# Altium project SingleBoardDrone.PrjPcb (part 1 of 2)
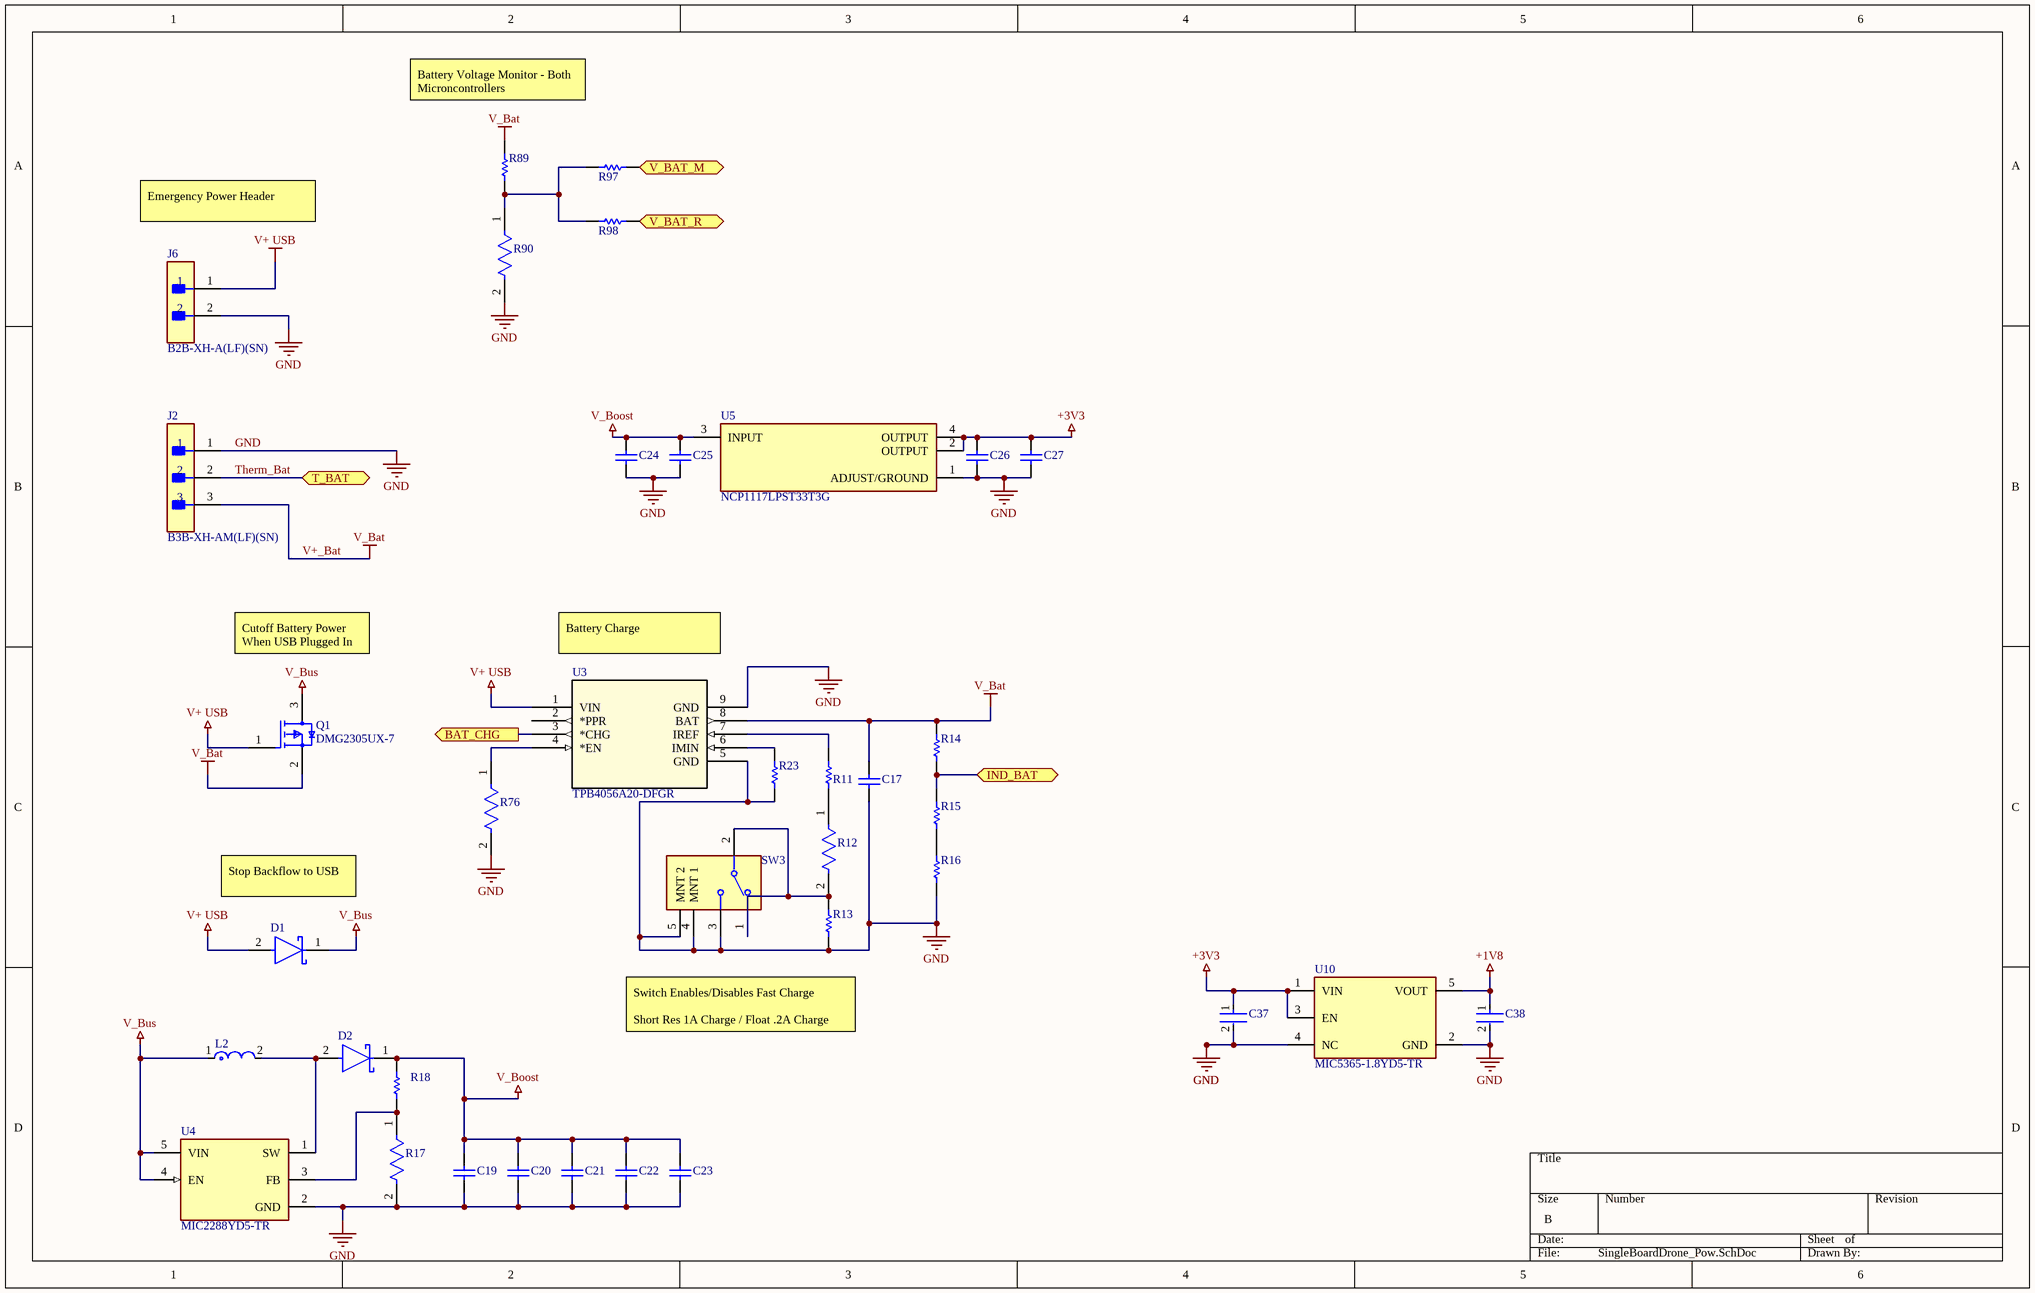
[diagram p0: SingleBoardDrone_Pow.SchDoc]
5 sheets, 230 parts. Net scope: flat (ports and power ports of the same name join across sheets).
Board file: SingleBoardDrone_.PcbDoc
Sheets:
  SingleBoardDrone_Pow.SchDoc
  SingleBoardDrone_RP2350.SchDoc
  SingleBoardDrone_Act.SchDoc
  SingleBoardDrone_Sens.SchDoc
  SingleBoardDrone_RF.SchDoc

## Sheet SingleBoardDrone_Pow.SchDoc
size B; SheetNumber: 1; SheetTotal: 5

### Parts
C17  CL10A475KQ8NNNC  [CAPC1608X90X30LL10T20]  (value not drawn)
C19  CL10A475KQ8NNNC  [CAPC1608X90X30LL10T20]  (value not drawn)
C20  CL10A475KQ8NNNC  [CAPC1608X90X30LL10T20]  (value not drawn)
C21  CL10A475KQ8NNNC  [CAPC1608X90X30LL10T20]  (value not drawn)
C22  CL10A475KQ8NNNC  [CAPC1608X90X30LL10T20]  (value not drawn)
C23  CL10A475KQ8NNNC  [CAPC1608X90X30LL10T20]  (value not drawn)
C24  CL10A475KQ8NNNC  [CAPC1608X90X30LL10T20]  (value not drawn)
C25  CL10A475KQ8NNNC  [CAPC1608X90X30LL10T20]  (value not drawn)
C26  CL10A475KQ8NNNC  [CAPC1608X90X30LL10T20]  (value not drawn)
C27  CL10A475KQ8NNNC  [CAPC1608X90X30LL10T20]  (value not drawn)
C37  CGA3E1X7R1E105K080AC  [FP-CGA3E-0_3-0_1-IPC_A]  (value not drawn)
C38  CGA3E1X7R1E105K080AC  [FP-CGA3E-0_3-0_1-IPC_A]  (value not drawn)
D1  PMEG3020DEP,115  [FP-SOD128-MFG]  (value not drawn)
D2  PMEG3020DEP,115  [FP-SOD128-MFG]  (value not drawn)
J2  B3B-XH-AM(LF)(SN)  [FP-B3B-XH-AM_LF_SN-MFG]
J6  B2B-XH-A(LF)(SN)  [FP-B2B-XH-A_LF_SN-MFG]
L2  VLS5045EX-100M  [FP-VLS5045EX-100M-MFG]  (value not drawn)
Q1  DMG2305UX-7  [FP-SOT23-IPC_B]
R11  ERJ-6ENF2000V  [RESC2013X70X40ML20T20]  (value not drawn)
R12  RMCF0402JT1K00  [FP-RMCF0402-IPC_B]  (value not drawn)
R13  CRCW08055K00FKTA  [RESC2013X50X30ML20T20]  (value not drawn)
R14  CRCW08055K00FKTA  [RESC2013X50X30ML20T20]  (value not drawn)
R15  CRCW08055K00FKTA  [RESC2013X50X30ML20T20]  (value not drawn)
R16  CRCW08055K00FKTA  [RESC2013X50X30ML20T20]  (value not drawn)
R17  RMCF0402JT1K00  [FP-RMCF0402-IPC_B]  (value not drawn)
R18  CRCW08055K00FKTA  [RESC2013X50X30ML20T20]  (value not drawn)
R23  CRCW08055K00FKTA  [RESC2013X50X30ML20T20]  (value not drawn)
R76  RC0402FR-070RL  [FP-RC0402-0_4-IPC_A]  (value not drawn)
R89  CRCW08055K00FKTA  [RESC2013X50X30ML20T20]  (value not drawn)
R90  RMCF0603JG10K0  [FP-RMCF0603-MFG]  (value not drawn)
R97  ERJ-6ENF2000V  [RESC2013X70X40ML20T20]  (value not drawn)
R98  ERJ-6ENF2000V  [RESC2013X70X40ML20T20]  (value not drawn)
SW3  1825232-1  [FP-1825232-1-MFG]  (value not drawn)
U3  TPB4056A20-DFGR  [DFN2X2-8_TPK]
U4  MIC2288YD5-TR  [FP-TSOT-5LD-PL-1-MFG]
U5  NCP1117LPST33T3G  [FP-318H-MFG]
U10  MIC5365-1.8YD5-TR  [FP-TSOT-5LD-PL-1-MFG]

### Ports
BAT_CHG (out, see SingleBoardDrone_RP2350[3B]), IND_BAT (bidir), T_BAT (bidir, see SingleBoardDrone_RP2350[3B]), V_BAT_M (bidir, see SingleBoardDrone_RP2350[3B]), V_BAT_R (bidir, see SingleBoardDrone_RF[3B])

### Nets
+1V8: C38.1 U10.5(VOUT)
+3V3: C26.1 C27.1 C37.1 U5.2(OUTPUT) U5.4(OUTPUT) U10.1(VIN) U10.3(EN)
GND: C17.2 C19.2 C20.2 C21.2 C22.2 C23.2 C24.2 C25.2 C26.2 C27.2 C37.2 C38.2 J2.1 J6.2 R13.2 R16.2 R17.2 R23.2 R76.2 R90.2 SW3.3 SW3.4(MNT_1) SW3.5(MNT_2) U3.5(GND) U3.9(GND) U4.2(GND) U5.1(ADJUST/GROUND) U10.2(GND) U10.4(NC)
V+ USB: D1.2(A) J6.1 Q1.1(GATE) U3.1(VIN)
V+_Bat: C17.1 J2.3 Q1.2(SOURCE) R14.1 R89.1 U3.8(BAT)  [also labelled V_Bat]
V_Boost: C19.1 C20.1 C21.1 C22.1 C23.1 C24.1 C25.1 D2.1(C) R18.1 U5.3(INPUT)
V_Bus: D1.1(C) L2.1 Q1.3(DRAIN) U4.4(EN) U4.5(VIN)
Therm_Bat: J2.2 ; port T_BAT
NetD2_2: D2.2(A) L2.2 U4.1(SW)
NetR11_1: R11.1 U3.7(IREF)
NetR11_2: R11.2 R12.1
NetR12_2: R12.2 R13.1 SW3.1 SW3.2
NetR14_2: R14.2 R15.1 ; port IND_BAT
NetR15_2: R15.2 R16.1
NetR17_1: R17.1 R18.2 U4.3(FB)
NetR23_1: R23.1 U3.6(IMIN)
NetR76_1: R76.1 U3.4(*EN)
NetR89_2: R89.2 R90.1 R97.2 R98.2
NetR97_1: R97.1 ; port V_BAT_M
NetR98_1: R98.1 ; port V_BAT_R
NetU1_41: U3.3(*CHG) ; port BAT_CHG

Not connected (* = marked no-connect by the designer): U3 2(*PPR)

### Notes on the sheet
- Battery Voltage Monitor - Both Microncontrollers
- Emergency Power Header
- Cutoff Battery Power When USB Plugged In
- Battery Charge
- Stop Backflow to USB
- (near R13) Switch Enables/Disables Fast Charge
  Short Res 1A Charge / Float .2A Charge

### Library data of the parts
C17 C19-C27 = CMP-2000-06090-1: Chip Capacitor, 4.7 uF, +/- 10%, 6.3 V, -55 to 85 degC, 0603 (1608 Metric), RoHS, Tape and Reel; Manufacturer: Samsung Electro-Mechanics; Dielectric: X5R; Capacitance: 4700000pF; Rated Voltage: 6.3V; Manufacturer URL: http://www.samsungsem.com/global/index.jsp; Case Size/Dimension: 0603; Package Description: 2-Pin Surface Mount Device, Body 1.60 x 0.80 mm; Datasheet Version: 07/2016; Datasheet URL: http://www.samsungsem.com/kr/support/product-search/mlcc/__icsFiles/afieldfile/2016/08/18/S_CL10A475KQ8NNNC.pdf; Tolerance (%): ±10%; Mounting Technology: SurfaceMount; Package Reference: 0603
C37 C38 = CMP-08246-001507-1: Cap Ceramic 1uF 25V X7R 10% Pad SMD 0603 +125°C Automotive T/R; Dielectric: X7R; Capacitance: 1uF; Voltage Rating: 25V; Thickness: 0.035inch; Width: 0.031inch; Ratings: AEC-Q200; Case Code (Metric): 1608; REACH SVHC: No SVHC; Voltage: 25V; Composition: Ceramic; Min Operating Temperature: -55°C; Termination: SMD/SMT; Depth: 0.8mm; Max Operating Temperature: 125°C; Mount: Surface Mount; Weight: 7.1E-05oz; Package Quantity: 4000; Tolerance: 10%; Packaging: Tape and Reel; Lead Free: Lead Free; Case/Package: 0603; Length: 1.6mm; Height: 0.8mm; Case Code (Imperial): 0603; Voltage Rating (DC): 25V
D1 D2 = CMP-14398-000018-1: DIODE SCHOTTKY 30V 2A SOD128
J2 = CMP-17438-000009-1: CONN HEADER VERT 3POS 2.5MM; Max Current Rating: 3A; Gender: Male; Max Voltage Rating (AC): 250V; Connector Type: Male Pin; Pitch: 0.098inch; Number of Positions: 3; Contact Resistance: 20mR; Termination: Press-Fit; Housing Color: White; Housing Material: Polyamide; Orientation: Straight; Contact Material: Brass; Contact Type: Male Pin; Color: Natural; Packaging: Bulk; Lead Free: Lead Free; Depth: 5.75mm; Number of Rows: 1; Contact Plating: Tin; Length: 9.9mm; Max Operating Temperature: 85°C; Series: XH; Min Operating Temperature: -25°C; Fastening Type: Detent; Mount: Through Hole
J6 = CMP-2000-05888-3: CONN HEADER VERT 2POS 2.5MM; Current Rating: 3A; Voltage Rating: 250V; Number of Contacts: 2; Contact Resistance: 20mR; Wire/Cable Gauge: 22AWG; Insulation Resistance: 1GR; Connector Type: Male Pin; Packaging: Bulk; Contact Material: Brass; Lead Free: Lead Free; Orientation: Straight; Contact Plating: Tin; Max Current Rating: 3A; Termination: Solder; Fastening Type: Detent; Depth: 5.75mm; Housing Material: Polyamide; REACH SVHC: No SVHC; Series: XH; Voltage Rating (AC): 250V; Number of Positions: 2; Color: Natural; Contact Type: Male Pin; Max Voltage Rating (DC): 250V; Pitch: 2.5mm; Lead Pitch: 2.5mm; Mount: Through Hole; Max Operating Temperature: 85°C; Length: 7.4mm; Max Voltage Rating (AC): 250V; Min Operating Temperature: -25°C; Number of Rows: 1; Housing Color: White
L2 = CMP-08253-000037-1: FIXED IND 10UH 2.5A 79.3 MOHM; Core Material: Ferrite; Test Frequency: 100kHz; Shielding: Shielded; DC Resistance (DCR): 61mR; Tolerance: 20%; Mount: Surface Mount; Current Rating: 2.5A; Case/Package: Nonstandard; Height - Seated (Max): 0.177inch; Min Operating Temperature: -40°C; Resistor Type: Wirewound; Max Operating Temperature: 105°C; Length: 0.197inch; Packaging: Tape and Reel; Width: 0.197inch; Inductance: 10uH; RoHS Compliant: Yes
Q1 = CMP-1693-00002-4: MOSFET P-CH 20V 4.2A SOT23; Turn-On Delay Time: 10.8ns; Turn-Off Delay Time: 79.3ns; Threshold Voltage: -900mV; Rise Time: 13.7ns; Gate to Source Voltage (Vgs): 8V; Rds On Max: 52mR; Element Configuration: Single; Fall Time: 34.7ns; Max Power Dissipation: 1.4W; Drain to Source Resistance: 200mR; Number of Channels: 1; Input Capacitance: 808pF; Lead Free: Lead Free; Number of Pins: 3; Length: 3mm; Continuous Drain Current (ID): 4.2A; Contact Plating: Tin; Mount: Surface Mount; Weight: 0.000282oz; Min Operating Temperature: -55°C; Package Quantity: 3000; Drain to Source Voltage (Vdss): 20V; On-State Resistance: 52MR; Max Operating Temperature: 150°C; Height: 1.1mm; REACH SVHC: No SVHC; Packaging: Tape and Reel; Radiation Hardening: No; Case/Package: SOT-23; Width: 1.4mm
R11 R97 R98 = CMP-2001-00025-1: Manufacturer: Panasonic; Part Number: ERJ-6ENF2000V
R12 R17 = CMP-26527-000131-1: 1kΩ ±5% 0.063W 0402 Thick Film Chip Resistor AEC-Q200 compliant; Power Rating: 62.5mW; Max Power Dissipation: 63mW; Temperature Coefficient: 100ppm/°C; Resistance: 1kR; Mount: Surface Mount; Min Operating Temperature: -55°C; Construction: Rectangular; Case/Package: 0402; Contact Plating: Tin; Case Code (Metric): 1005; Features: Automotive AEC-Q200; Series: RMCF; Lead Free: Lead Free; Length: 1mm; Case Code (Imperial): 0402; Depth: 0.5mm; Resistor Type: Thick Film; Packaging: Tape and Reel; Height: 0.016inch; Width: 0.02inch; Tolerance: 5%; Size Code: 0402; RoHS Compliant: Yes; Number of Terminations: 2; Max Operating Temperature: 155°C; Radiation Hardening: No; Military Standard: Not
R13-R16 R18 R23 R89 = CMP-2001-04239-1: Manufacturer: Vishay Dale; Part Number: CRCW08055K00FKTA
R76 = CMP-2002-07342-2: RES SMD 0 OHM JUMPER 1/16W 0402; Resistance: 0R; Temperature Coefficient: 200ppm/°C; Tolerance: 1%; Power Rating: 62.5mW; Voltage Rating: 50V; Max Power Dissipation: 63mW; Features: Moisture Resistant; Length: 1mm; Case Code (Metric): 1005; Series: RC; RoHS Compliant: Yes; Resistor Type: Thick Film; Height: 0.35mm; Min Operating Temperature: -55°C; Case Code (Imperial): 0402; Number of Terminations: 2; Contact Plating: Tin; Case/Package: 0402; Size Code: 0402; Termination: SMD/SMT; Max Operating Temperature: 155°C; Width: 0.5mm; Mount: Surface Mount; Lead Free: Lead Free; Packaging: Tape and Reel; Radiation Hardening: No
R90 = CMP-26527-000153-1: 10kΩ ±5% 0.1W 0603 Thick Film Chip Resistor AEC-Q200 compliant; Temperature Coefficient: 200ppm/°C; Resistance: 10kR; Max Power Dissipation: 100mW; Tolerance: 5%; Case Code (Imperial): 0603; Series: RMCF; Resistor Type: Thick Film; Length: 0.061inch; Features: Automotive AEC-Q200; Height: 0.022inch; Case Code (Metric): 1608; Width: 0.031inch; Number of Terminations: 2; Contact Plating: Tin; Case/Package: 0603; Package Quantity: 1; Max Operating Temperature: 155°C; Mount: Surface Mount; RoHS Compliant: Yes; Radiation Hardening: No; Min Operating Temperature: -55°C; Packaging: Tape and Reel
SW3 = CMP-03405-000001-1: SWITCH SLIDE SPDT 200MA 30V; Manufacturer: TE Connectivity; Contact Current Rating: 0.2A; Contact Resistance: 20mΩ; Electromechanical Life: 10000Cycles; Operating Force: 200gf; Throw Configuration: SPDT; Manufacturer Part Number: 1825232-1; Temperature Range High: +70°C; Height: 3.7mm; ComponentLink2URL: https://www.te.com/commerce/DocumentDelivery/DDEController?Action=showdoc&DocId=Customer+Drawing%7F1825232%7FB2%7Fpdf%7FEnglish%7FENG_CD_1825232_B2.pdf%7F1825232-1; Mount: Through Hole; Mouser Description: Slide Switches SLIDE SWITCH SPDT Right Angle; Package: 1825232-1; Temperature: -20°C to +70°C; Automotive: No; ComponentLink2Description: Datasheet; Lead Free: Yes; Octopart: https://octopart.com/1825232-1-te+connectivity-45209882; Device Class L1: Electromechanical; Digikey Description: SWITCH SLIDE SPDT 200MA 30V; Device Class L3: Slide Switches; Device Class L2: Switches; Voltage Rating Dc: 30V; Temperature Range Low: -20°C; Category: Switch; RoHS: TRUE
U3 = TPB4056A20-DFGR: No Description Available; Manufacturer_Name: 3Peak; Copyright: Copyright (C) 2025 Ultra Librarian. All rights reserved.; Manufacturer_Part_Number: TPB4056A20-DFGR; RefDes: RefDes; Type: Type
U4 = CMP-06325-000011-1: IC REG BOOST ADJ 1.2A TSOT23-5; Number of Outputs: 1; Output Current: 1A; Operating Supply Voltage: 10V; Switching Frequency: 1.2MHz; Output Configuration: Positive; Max Output Voltage: 34V; Min Input Voltage: 2.5V; Synchronous Rectifier: No; Output Type: Adjustable; Max Input Voltage: 10V; Width: 1.6mm; Max Output Current: 1A; Packaging: Tape and Reel; Max Operating Temperature: 125°C; Min Operating Temperature: -40°C; Package Quantity: 3000; Height: 0.87mm; Output Voltage: 34V; Min Output Voltage: 2.5V; Lead Free: Lead Free; Length: 2.9mm; REACH SVHC: No SVHC; Radiation Hardening: No; Min Supply Voltage: 2.5V; Case/Package: TSOT; Number of Pins: 5; Mount: Surface Mount; Topology: Boost
U5 = CMP-07128-000031-1: IC REG LINEAR 3.3V 1A SOT223; Output Type: Fixed; Dropout Voltage: 1.3V; Min Input Voltage: -300mV; Power Supply Rejection Ratio (PSRR): 60dB; Number of Outputs: 1; Reference Voltage: 1.275V; Quiescent Current: 700uA; Max Input Voltage: 18V; Polarity: Positive; Min Current Limit: 1.1A; Height: 1.69mm; Mount: Surface Mount; Min Output Voltage: 3.3V; Case/Package: SOT-223; Length: 6.7mm; Nominal Output Voltage: 3.3V; Output Current: 1A; Number of Regulators: 1; Max Operating Temperature: 125°C; Packaging: Tape and Reel; Number of Pins: 3; Min Operating Temperature: 0°C; Halogen Free: Halogen Free; Contact Plating: Tin; Width: 3.7mm; REACH SVHC: No SVHC; Package Quantity: 1; Output Voltage: 3.3V; Lead Free: Lead Free; Max Output Current: 1A
U10 = CMP-00252-66803184-1: MIC5365-1.8YD5-TR LDO Regulator Pos 1.8V 0.15A 5-Pin TSOT-23 T/R; Polarity: Positive; Number of Regulators: 1; Output Voltage Accuracy: 2%; Min Current Limit: 200mA; Min Input Voltage: 2.5V; Quiescent Current: 39µA; Output Current: 150mA; Dropout Voltage: 180mV; Max Input Voltage: 5.5V; Power Supply Rejection Ratio (PSRR): 80dB; Output Type: Fixed; Mount: Surface Mount; Min Operating Temperature: -40°C; Max Operating Temperature: 125°C; Output Voltage: 1.8V; Case/Package: SOT-23-5; Lifecycle Status: Production; RoHS: Compliant; Lead Free: Lead Free; Number of Outputs: 1; NexarPartId: 66803184; Number of Pins: 23

## Sheet SingleBoardDrone_RP2350.SchDoc
size B; SheetNumber: 2; SheetTotal: 5
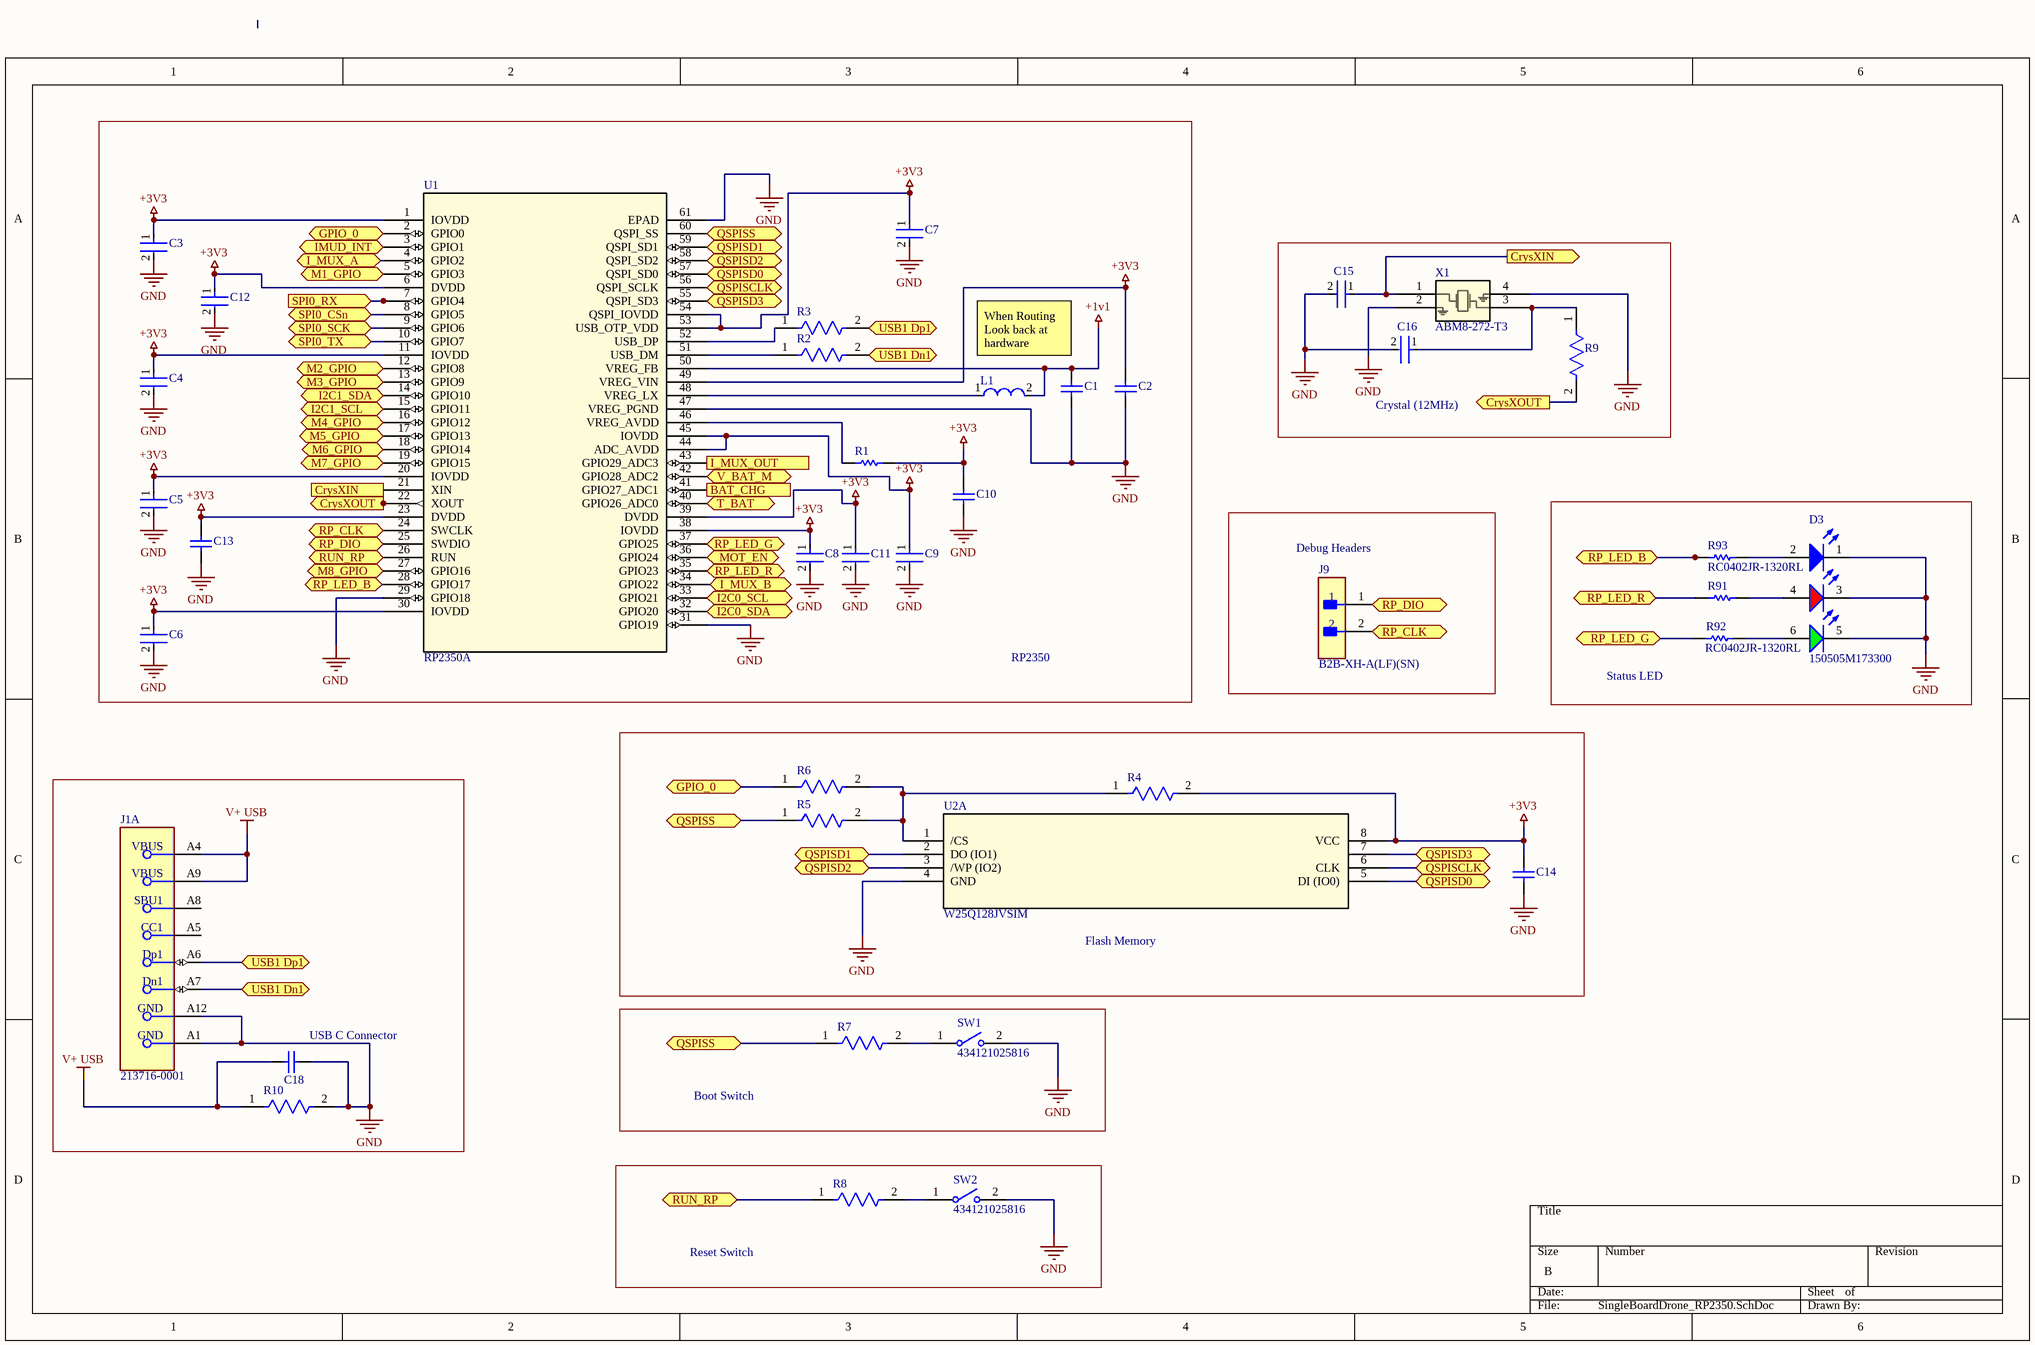
[diagram p1: SingleBoardDrone_RP2350.SchDoc]

### Parts
C1  CL10A475KQ8NNNC  [CAPC1608X90X30LL10T20]  (value not drawn)
C2  CL10A475KQ8NNNC  [CAPC1608X90X30LL10T20]  (value not drawn)
C3  CL03A104KP3NNNC  [FP-CL03-IPC_C]  (value not drawn)
C4  CL03A104KP3NNNC  [FP-CL03-IPC_C]  (value not drawn)
C5  CL03A104KP3NNNC  [FP-CL03-IPC_C]  (value not drawn)
C6  CL03A104KP3NNNC  [FP-CL03-IPC_C]  (value not drawn)
C7  CL03A104KP3NNNC  [FP-CL03-IPC_C]  (value not drawn)
C8  CL03A104KP3NNNC  [FP-CL03-IPC_C]  (value not drawn)
C9  CL03A104KP3NNNC  [FP-CL03-IPC_C]  (value not drawn)
C10  CL10A475KQ8NNNC  [CAPC1608X90X30LL10T20]  (value not drawn)
C11  CL03A104KP3NNNC  [FP-CL03-IPC_C]  (value not drawn)
C12  CL03A104KP3NNNC  [FP-CL03-IPC_C]  (value not drawn)
C13  CL10A475KQ8NNNC  [CAPC1608X90X30LL10T20]  (value not drawn)
C14  CL10A475KQ8NNNC  [CAPC1608X90X30LL10T20]  (value not drawn)
C15  CC0402JRNPO9BN150  [FP-CC0402-0_55-IPC_B]  (value not drawn)
C16  CC0402JRNPO9BN150  [FP-CC0402-0_55-IPC_B]  (value not drawn)
C18  CL10A475KQ8NNNC  [CAPC1608X90X30LL10T20]  (value not drawn)
D3  150505M173300  [WL-SFTW_5050_150505M173300]
J1  213716-0001  [FP-213716-0001-MFG]  (part A of 3)
J9  B2B-XH-A(LF)(SN)  [FP-B2B-XH-A_LF_SN-MFG]
L1  MLZ2012A3R3WT000  [FP-MLZ2012-0_85-IPC_C]  (value not drawn)
R1  RC0603JR-1333RL  [RESC1608X55X25LL10T15]  (value not drawn)
R2  AC0402FR-0727RL  [FP-AC0402-IPC_C]  (value not drawn)
R3  AC0402FR-0727RL  [FP-AC0402-IPC_C]  (value not drawn)
R4  RMCF0603JG10K0  [FP-RMCF0603-MFG]  (value not drawn)
R5  RC0402FR-070RL  [FP-RC0402-0_4-IPC_A]  (value not drawn)
R6  RC0402FR-070RL  [FP-RC0402-0_4-IPC_A]  (value not drawn)
R7  RMCF0402JT1K00  [FP-RMCF0402-IPC_B]  (value not drawn)
R8  RMCF0402JT1K00  [FP-RMCF0402-IPC_B]  (value not drawn)
R9  RMCF0402JT1K00  [FP-RMCF0402-IPC_B]  (value not drawn)
R10  RMCF0603JG10K0  [FP-RMCF0603-MFG]  (value not drawn)
R91  ERJ-3EKF1400V  [RESC1608X55X30NL15T15]  (value not drawn)
R92  RC0402JR-1320RL  [RESC1005X40X25NL05T10]
R93  RC0402JR-1320RL  [RESC1005X40X25NL05T10]
SW1  434121025816  [434121025816]
SW2  434121025816  [434121025816]
U1  RP2350A  [QFN-60_7X7_RPI]
U2  W25Q128JVSIM  [SOIC_128JVSIM_WIN]  (part A of 2)
X1  ABM8-272-T3  [XTAL_ABM8-272-T3]

### Blocks framed on the sheet
RP2350: C1-C13 L1 R1-R3 U1
Crystal (12MHz): C15 C16 R9 X1
Status LED: D3 R91-R93
Debug Headers: J9
Flash Memory: C14 R4-R6 U2
USB C Connector: C18 J1 R10
Boot Switch: R7 SW1
Reset Switch: R8 SW2

### Ports
BAT_CHG (in, see SingleBoardDrone_Pow[2C]), CrysXIN (in, see SingleBoardDrone_RP2350[5A]), CrysXIN (out, see SingleBoardDrone_RP2350[1B]), CrysXOUT (out, see SingleBoardDrone_RP2350[1B]), CrysXOUT (out, see SingleBoardDrone_RP2350[5B]), GPIO_0 (bidir, see SingleBoardDrone_Act[5C], SingleBoardDrone_RP2350[1A]), GPIO_0 (bidir, see SingleBoardDrone_Act[5C], SingleBoardDrone_RP2350[2C]), I2C0_SCL (bidir, see SingleBoardDrone_Sens[3A], SingleBoardDrone_Sens[3C]), I2C0_SDA (bidir, see SingleBoardDrone_Sens[3A], SingleBoardDrone_Sens[3C]), I2C1_SCL (bidir, see SingleBoardDrone_RF[3B]), I2C1_SDA (bidir, see SingleBoardDrone_RF[3B]), I_MUX_A (bidir, see SingleBoardDrone_Act[5C]), I_MUX_B (bidir, see SingleBoardDrone_Act[5C]), I_MUX_OUT (in, see SingleBoardDrone_Act[5D]), IMUD_INT (bidir, see SingleBoardDrone_Sens[2C], SingleBoardDrone_Sens[3B]), M1_GPIO (bidir, see SingleBoardDrone_Act[2A]), M2_GPIO (bidir, see SingleBoardDrone_Act[2A]), M3_GPIO (bidir, see SingleBoardDrone_Act[4A]), M4_GPIO (bidir, see SingleBoardDrone_Act[4A]), M5_GPIO (bidir, see SingleBoardDrone_Act[2C]), M6_GPIO (bidir, see SingleBoardDrone_Act[2C]), M7_GPIO (bidir, see SingleBoardDrone_Act[4C]), M8_GPIO (bidir, see SingleBoardDrone_Act[4C]), MOT_EN (bidir, see SingleBoardDrone_Act[6B]), QSPISCLK (bidir, see SingleBoardDrone_RP2350[3A]), QSPISCLK (bidir, see SingleBoardDrone_RP2350[5C]), QSPISD0 (bidir, see SingleBoardDrone_RP2350[3A]), QSPISD0 (bidir, see SingleBoardDrone_RP2350[5C]), QSPISD1 (bidir, see SingleBoardDrone_RP2350[3A]), QSPISD1 (bidir, see SingleBoardDrone_RP2350[3C]), QSPISD2 (bidir, see SingleBoardDrone_RP2350[3A]), QSPISD2 (bidir, see SingleBoardDrone_RP2350[3C]), QSPISD3 (bidir, see SingleBoardDrone_RP2350[3A]), QSPISD3 (bidir, see SingleBoardDrone_RP2350[5C]), QSPISS (bidir, see SingleBoardDrone_RP2350[2C], SingleBoardDrone_RP2350[2D]), QSPISS (bidir, see SingleBoardDrone_RP2350[2C], SingleBoardDrone_RP2350[3A]), QSPISS (bidir, see SingleBoardDrone_RP2350[2D], SingleBoardDrone_RP2350[3A]), RP_CLK (bidir, see SingleBoardDrone_RP2350[1B]), RP_CLK (bidir, see SingleBoardDrone_RP2350[5B]), RP_DIO (bidir, see SingleBoardDrone_RP2350[1B]), RP_DIO (bidir, see SingleBoardDrone_RP2350[5B]), RP_LED_B (bidir, see SingleBoardDrone_RP2350[1B]), RP_LED_B (bidir, see SingleBoardDrone_RP2350[5B]), RP_LED_G (bidir, see SingleBoardDrone_RP2350[3B]), RP_LED_G (bidir, see SingleBoardDrone_RP2350[5B]), RP_LED_R (bidir, see SingleBoardDrone_RP2350[3B]), RP_LED_R (bidir, see SingleBoardDrone_RP2350[5B]), RUN_RP (bidir, see SingleBoardDrone_RP2350[1B]), RUN_RP (bidir, see SingleBoardDrone_RP2350[2D]), SPI0_CSn (bidir, see SingleBoardDrone_Sens[1A]), SPI0_RX (in, see SingleBoardDrone_Sens[2A]), SPI0_SCK (bidir, see SingleBoardDrone_Sens[1A]), SPI0_TX (bidir, see SingleBoardDrone_Sens[2A]), T_BAT (bidir, see SingleBoardDrone_Pow[1B]), USB1 Dn1 (bidir, see SingleBoardDrone_RP2350[1C]), USB1 Dn1 (bidir, see SingleBoardDrone_RP2350[3A]), USB1 Dp1 (bidir, see SingleBoardDrone_RP2350[1C]), USB1 Dp1 (bidir, see SingleBoardDrone_RP2350[3A]), V_BAT_M (bidir, see SingleBoardDrone_Pow[2A])

### Nets
+1v1: C1.1 L1.2 U1.50(VREG_FB)
+3V3: C2.1 C3.1 C4.1 C5.1 C6.1 C7.1 C8.1 C9.1 C10.1 C11.1 C12.1 C13.1 C14.1 R1.2 R4.2 U1.1(IOVDD) U1.6(DVDD) U1.11(IOVDD) U1.20(IOVDD) U1.23(DVDD) U1.30(IOVDD) U1.38(IOVDD) U1.39(DVDD) U1.44(ADC_AVDD) U1.45(IOVDD) U1.49(VREG_VIN) U1.53(USB_OTP_VDD) U1.54(QSPI_IOVDD) U2.8(VCC)
GND: C1.2 C2.2 C3.2 C4.2 C5.2 C6.2 C7.2 C8.2 C9.2 C10.2 C11.2 C12.2 C13.2 C14.2 C15.2 C16.2 C18.1 D3.1(K) D3.3(K) D3.5(K) J1.A1(GND) J1.A12(GND) R10.2 SW1.2 SW2.2 U1.29(GPIO18) U1.31(GPIO19) U1.47(VREG_PGND) U1.61(EPAD) U2.4(GND) X1.2 X1.4
V+ USB: C18.2 J1.A4(VBUS) J1.A9(VBUS) R10.1
Therm_Bat: U1.40(GPIO26_ADC0) ; port T_BAT
NetA1_2: U1.9(GPIO6) ; port SPI0_SCK
NetA1_4: U1.10(GPIO7) ; port SPI0_TX
NetA1_6: U1.8(GPIO5) ; port SPI0_CSn
NetA1_7: U1.7(GPIO4) ; port SPI0_RX
NetC15_1: C15.1 U1.21(XIN) X1.1 ; port CrysXIN
NetC16_1: C16.1 R9.1 X1.3
NetD3_2: D3.2(A) R93.2
NetD3_4: D3.4(A) R91.2
NetD3_6: D3.6(A) R92.2
NetJ1_A6: J1.A6(Dp1) R3.2 ; port USB1 Dp1
NetJ1_A7: J1.A7(Dn1) R2.2 ; port USB1 Dn1
NetJ3_4: U1.33(GPIO21) ; port I2C0_SCL
NetJ3_5: U1.32(GPIO20) ; port I2C0_SDA
NetJ3_7: U1.3(GPIO1) ; port IMUD_INT
NetJ9_1: J9.1 U1.25(SWDIO) ; port RP_DIO
NetJ9_2: J9.2 U1.24(SWCLK) ; port RP_CLK
NetL1_1: L1.1 U1.48(VREG_LX)
NetQ2_1: U1.36(GPIO24) ; port MOT_EN
NetR1_1: R1.1 U1.46(VREG_AVDD)
NetR2_1: R2.1 U1.51(USB_DM)
NetR3_1: R3.1 U1.52(USB_DP)
NetR4_1: R4.1 R5.2 R6.2 U2.1(/CS)
NetR5_1: R5.1 R7.1 U1.60(QSPI_SS) ; port QSPISS
NetR6_1: R6.1 U1.2(GPIO0) ; port GPIO_0
NetR7_2: R7.2 SW1.1
NetR8_1: R8.1 U1.26(RUN) ; port RUN_RP
NetR8_2: R8.2 SW2.1
NetR9_2: R9.2 U1.22(XOUT) ; port CrysXOUT
NetR91_1: R91.1 U1.35(GPIO23) ; port RP_LED_R
NetR92_1: R92.1 U1.37(GPIO25) ; port RP_LED_G
NetR93_1: R93.1 U1.28(GPIO17) ; port RP_LED_B
NetR97_1: U1.42(GPIO28_ADC2) ; port V_BAT_M
NetU1_4: U1.4(GPIO2) ; port I_MUX_A
NetU1_5: U1.5(GPIO3) ; port M1_GPIO
NetU1_12: U1.12(GPIO8) ; port M2_GPIO
NetU1_13: U1.13(GPIO9) ; port M3_GPIO
NetU1_14: U1.14(GPIO10) ; port I2C1_SDA
NetU1_15: U1.15(GPIO11) ; port I2C1_SCL
NetU1_16: U1.16(GPIO12) ; port M4_GPIO
NetU1_17: U1.17(GPIO13) ; port M5_GPIO
NetU1_18: U1.18(GPIO14) ; port M6_GPIO
NetU1_19: U1.19(GPIO15) ; port M7_GPIO
NetU1_27: U1.27(GPIO16) ; port M8_GPIO
NetU1_34: U1.34(GPIO22) ; port I_MUX_B
NetU1_41: U1.41(GPIO27_ADC1) ; port BAT_CHG
NetU1_43: U1.43(GPIO29_ADC3) ; port I_MUX_OUT
NetU1_55: U1.55(QSPI_SD3) U2.7 ; port QSPISD3
NetU1_56: U1.56(QSPI_SCLK) U2.6(CLK) ; port QSPISCLK
NetU1_57: U1.57(QSPI_SD0) U2.5(DI_(IO0)) ; port QSPISD0
NetU1_58: U1.58(QSPI_SD2) U2.3(/WP_(IO2)) ; port QSPISD2
NetU1_59: U1.59(QSPI_SD1) U2.2(DO_(IO1)) ; port QSPISD1

Not connected (* = marked no-connect by the designer): J1 A5(CC1) A8(SBU1)

### Notes on the sheet
- When Routing Look back at hardware guide... they have an ideal oreitnation for the inductor....
  They recomend aota-b201610s3r3-101-t

### Library data of the parts
C1 C2 C10 C13 C14 C18 = CMP-2000-06090-1: as C17 on sheet SingleBoardDrone_Pow; Manufacturer URL: http://www.samsungsem.com/global/index.jsp; Case Size/Dimension: 0603; Package Description: 2-Pin Surface Mount Device, Body 1.60 x 0.80 mm; Datasheet Version: 07/2016; Datasheet URL: http://www.samsungsem.com/kr/support/product-search/mlcc/__icsFiles/afieldfile/2016/08/18/S_CL10A475KQ8NNNC.pdf; Tolerance (%): ±10%; Mounting Technology: SurfaceMount; Package Reference: 0603
C3-C9 C11 C12 = CMP-2010-00672-2: Cap Ceramic 100nF 10V X5R ±10% Pad SMD 0201 +85°C T/R; Radiation Hardening: No; Voltage Rating: 10V; Dielectric: X5R; Length: 0.6mm; Voltage Rating (DC): 10V; Package Quantity: 1; Height: 0.3mm; Width: 0.012inch; Min Operating Temperature: -55°C; Lead Free: Lead Free; Tolerance: 10%; Contact Plating: Tin; Depth: 0.3mm; Max Operating Temperature: 85°C; Case/Package: 0201; Capacitance: 100nF; Mount: Surface Mount; Thickness: 0.013inch; Case Code (Metric): 0603; Case Code (Imperial): 0201; Packaging: Tape and Reel
C15 C16 = CMP-03422-001519-1: CAP CER 15PF 50V C0G/NPO 0402; Insulation Resistance: 100GR; Dielectric Material: Ceramic; Tolerance: 5%; Dielectric: C0G; Width: 0.02inch; Case Code (Imperial): 0402; Voltage Rating (DC): 50V; Case Code (Metric): 1005; REACH SVHC: No SVHC; Mount: Surface Mount; Min Operating Temperature: -55°C; Depth: 0.5mm; Voltage Rating: 50V; Voltage: 50V; Thickness: 0.022inch; Length: 1mm; Max Operating Temperature: 125°C; Lead Free: Lead Free; Capacitance: 15pF; Height: 0.5mm; Packaging: Tape and Reel; Radiation Hardening: No; Package Quantity: 1; Case/Package: 0402; Number of Pins: 2; RoHS Compliant: Yes; Resistor Type: Ceramic; Series: CC; Termination: SMD/SMT
D3 = CMP-03913-90235585-1: 150505M173300 WL-SFTW SMT full-color TOP LED waterclear; Max Reverse Voltage (DC): 5V; Forward Current: 80mA; Max Junction Temperature (Tj): 115°C; Peak Wavelength: 465nm; Color: Blue, Green, Red; Viewing Angle: 120°; Luminous Intensity: 350mcd; Dominant Wavelength: 520nm; Forward Voltage: 2V; Power Dissipation: 72mW; Length: 5.4mm; Width: 5mm; Min Operating Temperature: -40°C; Height: 1.5mm; Packaging: Tape and Reel; Max Operating Temperature: 85°C; RoHS: Compliant; Reverse Voltage: 5V; NexarPartId: 90235585
J1 = CMP-04767-000029-1: CONN RCPT USB2.0 TYPE C 24POS RA
J9 = CMP-2000-05888-3: as J6 on sheet SingleBoardDrone_Pow; Packaging: Bulk; Contact Material: Brass; Lead Free: Lead Free; Orientation: Straight; Contact Plating: Tin; Max Current Rating: 3A; Termination: Solder; Fastening Type: Detent; Depth: 5.75mm; Housing Material: Polyamide; REACH SVHC: No SVHC; Series: XH; Voltage Rating (AC): 250V; Number of Positions: 2; Color: Natural; Contact Type: Male Pin; Max Voltage Rating (DC): 250V; Pitch: 2.5mm; Lead Pitch: 2.5mm; Mount: Through Hole; Max Operating Temperature: 85°C; Length: 7.4mm; Max Voltage Rating (AC): 250V; Min Operating Temperature: -25°C; Number of Rows: 1; Housing Color: White
L1 = CMP-08253-000308-1: Shielded Multilayer Inductor 3.3uH ±20% 450mA 442mΩ SMD 0805; Saturation Current: 200mA; Self Resonant Frequency: 90MHz; DC Resistance (DCR): 442mR; Core Material: Ferrite; Test Frequency: 10MHz; Current Rating: 450mA; Shielding: Shielded; Lead Free: Lead Free; Length: 0.079inch; Inductance: 3.3uH; Max Operating Temperature: 125°C; Height - Seated (Max): 0.041inch; Tolerance: 20%; Mount: Surface Mount; Package Quantity: 1; Case/Package: 0805; Case Code (Metric): 2012; Min Operating Temperature: -55°C; Packaging: Cut Tape; RoHS Compliant: Yes; Case Code (Imperial): 0805; Width: 0.049inch
R1 = CMP-2000-04324-1: Manufacturer: Yageo; Part Number: RC0603JR-1333RL
R2 R3 = CMP-03412-005338-2: RES 27Ω ±1% 0.063W 0402; Temperature Coefficient: 100ppm/°C; Max Power Dissipation: 63mW; Resistance: 27R; Series: AC; Tolerance: 1%; Length: 0.039inch; Number of Terminations: 2; Case/Package: 0402; Features: Moisture Resistant; Min Operating Temperature: -55°C; Max Operating Temperature: 155°C; Resistor Type: Thick Film; Width: 0.02inch; RoHS Compliant: Yes; Packaging: Tape and Reel; Height: 0.015inch
R4 R10 = CMP-26527-000153-1: as R90 on sheet SingleBoardDrone_Pow; Tolerance: 5%; Case Code (Imperial): 0603; Series: RMCF; Resistor Type: Thick Film; Length: 0.061inch; Features: Automotive AEC-Q200; Height: 0.022inch; Case Code (Metric): 1608; Width: 0.031inch; Number of Terminations: 2; Contact Plating: Tin; Case/Package: 0603; Package Quantity: 1; Max Operating Temperature: 155°C; Mount: Surface Mount; RoHS Compliant: Yes; Radiation Hardening: No; Min Operating Temperature: -55°C; Packaging: Tape and Reel
R5 R6 = CMP-2002-07342-2: as R76 on sheet SingleBoardDrone_Pow; Features: Moisture Resistant; Length: 1mm; Case Code (Metric): 1005; Series: RC; RoHS Compliant: Yes; Resistor Type: Thick Film; Height: 0.35mm; Min Operating Temperature: -55°C; Case Code (Imperial): 0402; Number of Terminations: 2; Contact Plating: Tin; Case/Package: 0402; Size Code: 0402; Termination: SMD/SMT; Max Operating Temperature: 155°C; Width: 0.5mm; Mount: Surface Mount; Lead Free: Lead Free; Packaging: Tape and Reel; Radiation Hardening: No
R7-R9 = CMP-26527-000131-1: as R12 on sheet SingleBoardDrone_Pow; Mount: Surface Mount; Min Operating Temperature: -55°C; Construction: Rectangular; Case/Package: 0402; Contact Plating: Tin; Case Code (Metric): 1005; Features: Automotive AEC-Q200; Series: RMCF; Lead Free: Lead Free; Length: 1mm; Case Code (Imperial): 0402; Depth: 0.5mm; Resistor Type: Thick Film; Packaging: Tape and Reel; Height: 0.016inch; Width: 0.02inch; Tolerance: 5%; Size Code: 0402; RoHS Compliant: Yes; Number of Terminations: 2; Max Operating Temperature: 155°C; Radiation Hardening: No; Military Standard: Not
R91 = CMP-2000-00245-1: Manufacturer: Panasonic; Part Number: ERJ-3EKF1400V
R92 R93 = CMP-2002-08072-1: Manufacturer: Yageo; Part Number: RC0402JR-1320RL
SW1 SW2 = CMP-1459-00004-3: Switch Tactile Spst-no 0.05A 12V; Operating Force: 1.56N; Contact Resistance: 100mΩ; Switch Function: Off-Mom; Mechanical Life: 50kcycles; Switch Travel: 250µm; Actuator Material: Liquid Crystal Polymer, Polymer; Current Rating: 50mA; Throw Configuration: SPST; Actuator Length: 800µm; Illumination Type: Illuminated, Non-Illuminated; Color: Black; Height: 2.5mm; Contact Material: Stainless Steel, Steel; Voltage Rating: 12V; Packaging: Tape and Reel; Contact Plating: Silver; Max Operating Temperature: 85°C; RoHS: Compliant; Lead Free: Lead Free; Termination: SMD/SMT; REACH SVHC: No SVHC; Mount: Surface Mount; Min Operating Temperature: -40°C; Length: 7.3mm; Insulation Resistance: 100MΩ; Contact Current Rating: 50mA
U1 = RP2350A: No Description Available; Manufacturer_Name: Raspberry Pi; Copyright: Copyright (C) 2025 Ultra Librarian. All rights reserved.; Manufacturer_Part_Number: RP2350A; RefDes: RefDes; Type: Type
U2 = W25Q128JVSIM: No Description Available; Manufacturer_Name: Winbond; Copyright: Copyright (C) 2025 Ultra Librarian. All rights reserved.; Manufacturer_Part_Number: W25Q128JVSIM; RefDes: RefDes; Type: Type
X1 = ABM8-272-T3: No Description Available; Manufacturer_Name: Abracon; Type: Crystals; Copyright: Copyright (C) 2025 Ultra Librarian. All rights reserved.; Manufacturer_Part_Number: ABM8-272-T3; RefDes: RefDes

## Sheet SingleBoardDrone_Act.SchDoc
size C; SheetNumber: 3; SheetTotal: 5
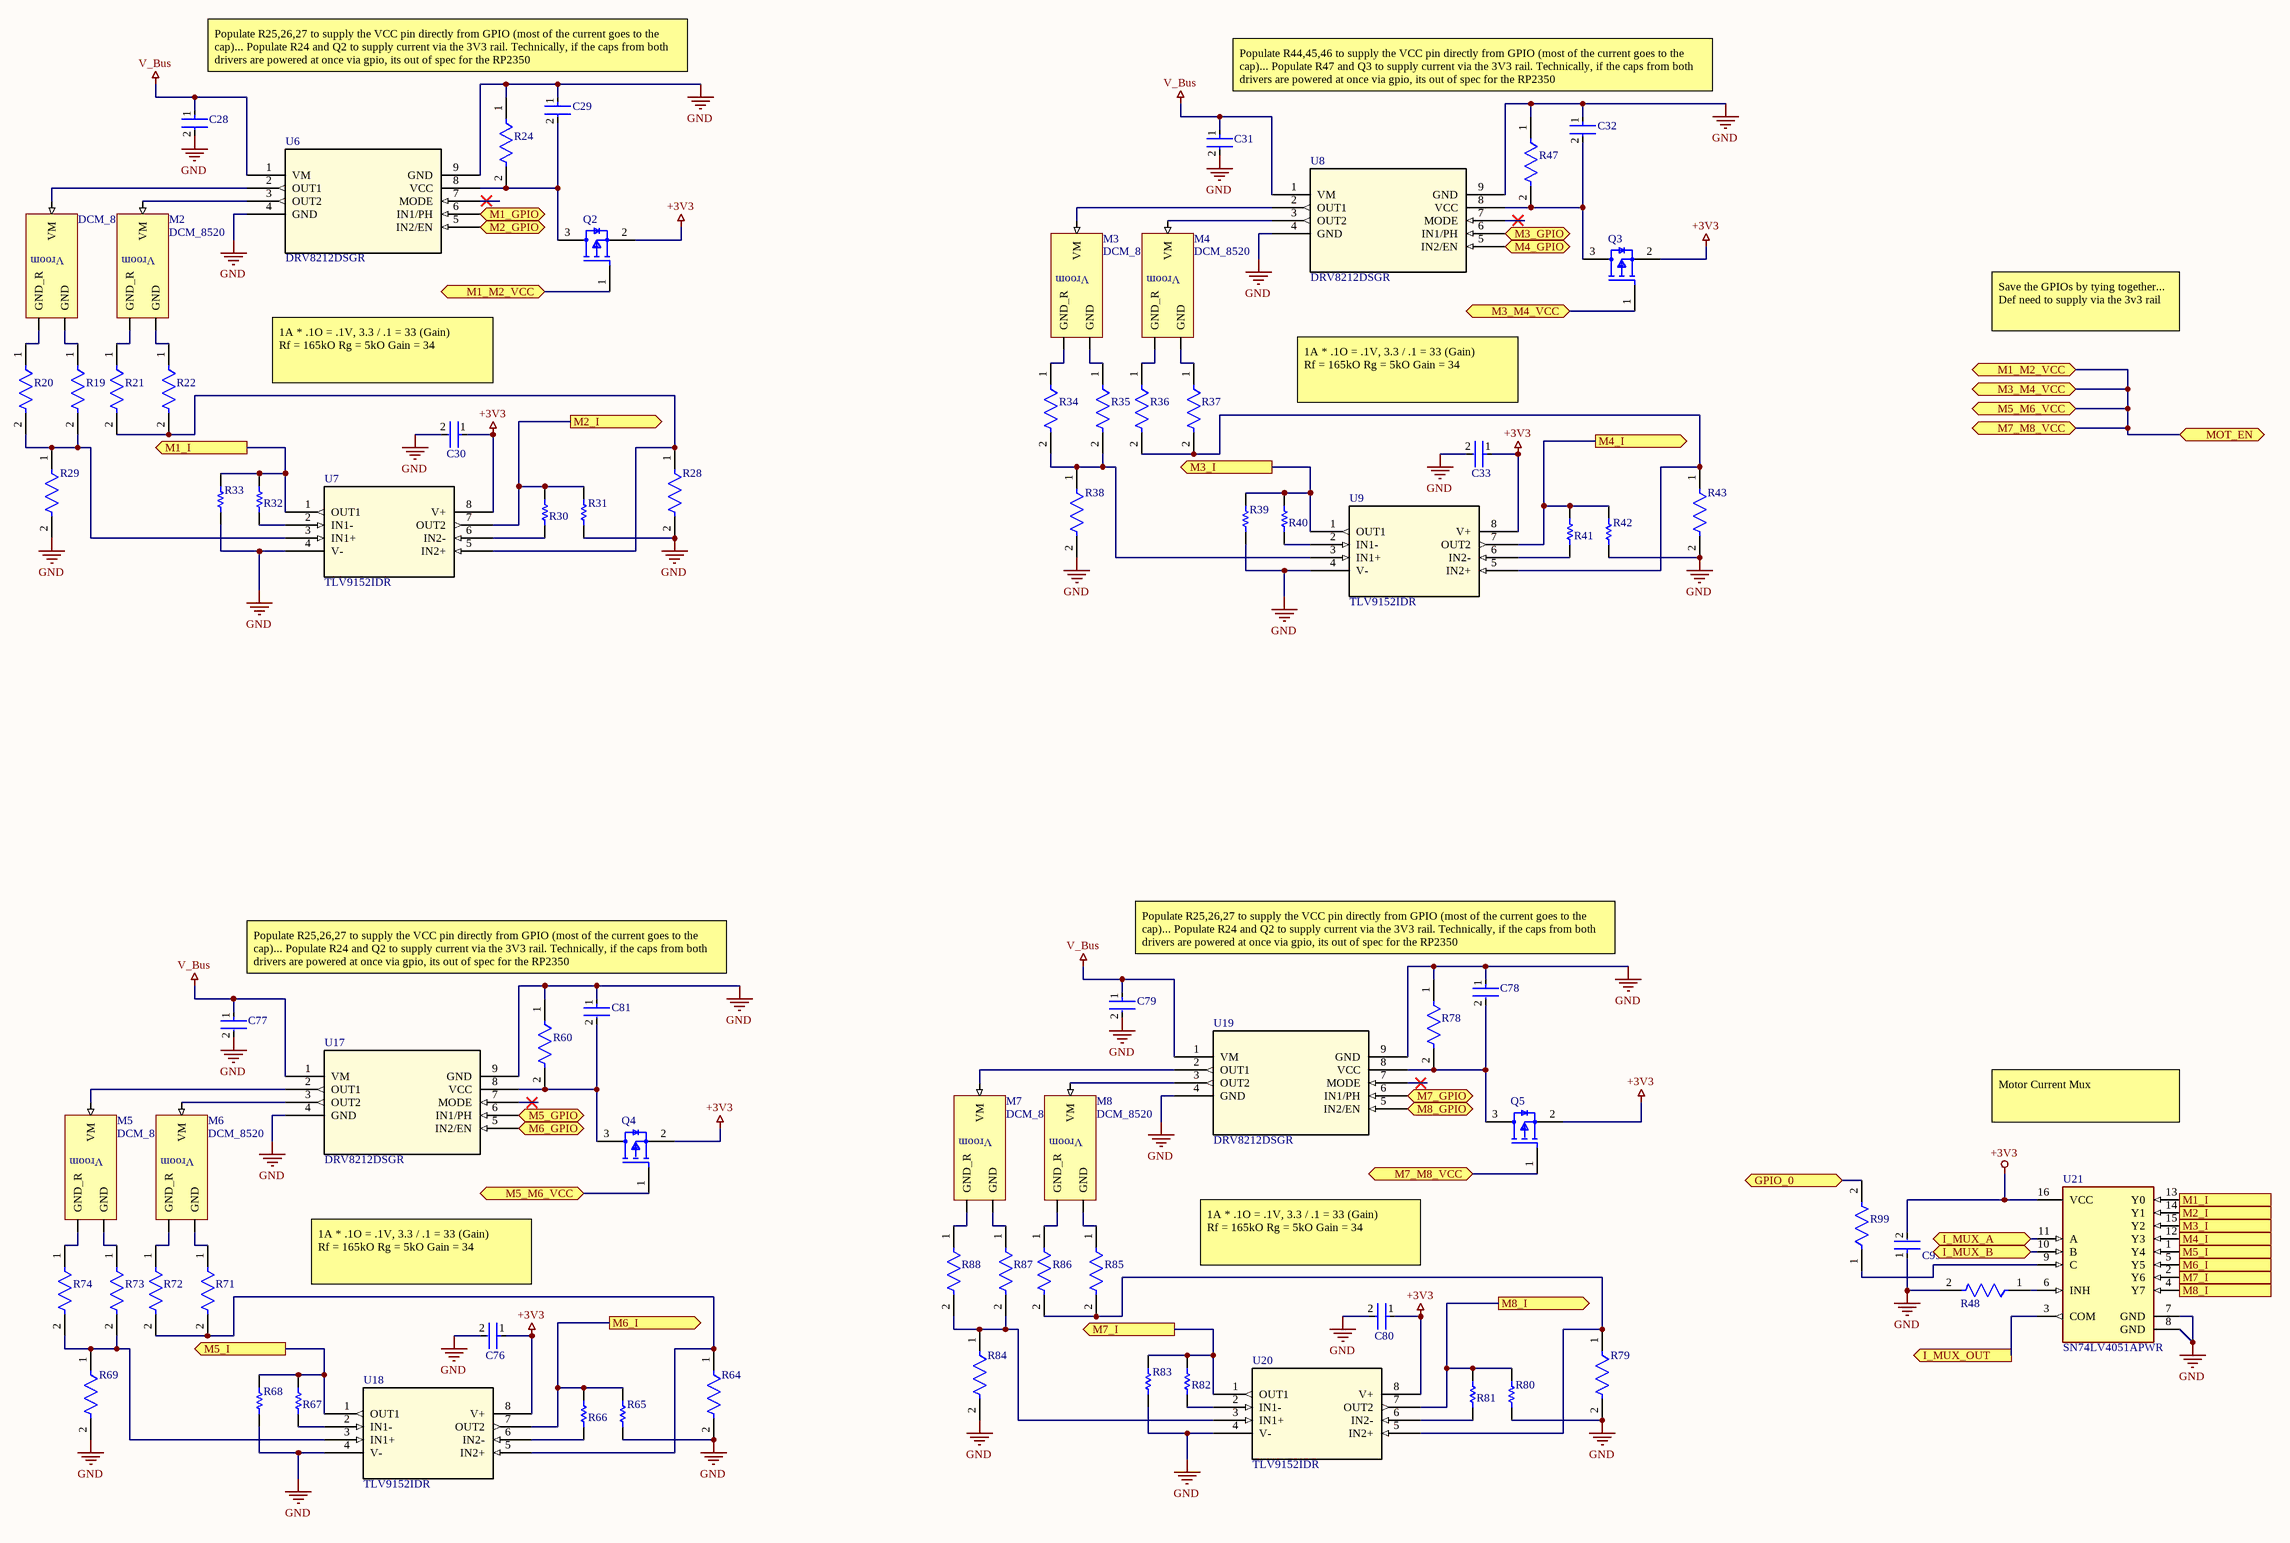
[diagram p2: SingleBoardDrone_Act.SchDoc]

### Parts
?  DCM_8520  [PCBComponent_1]  (no BOM)
C28  CL03A104KP3NNNC  [FP-CL03-IPC_C]  (value not drawn)
C29  CL03A104KP3NNNC  [FP-CL03-IPC_C]  (value not drawn)
C30  CL03A104KP3NNNC  [FP-CL03-IPC_C]  (value not drawn)
C31  CL03A104KP3NNNC  [FP-CL03-IPC_C]  (value not drawn)
C32  CL03A104KP3NNNC  [FP-CL03-IPC_C]  (value not drawn)
C33  CL03A104KP3NNNC  [FP-CL03-IPC_C]  (value not drawn)
C76  CL03A104KP3NNNC  [FP-CL03-IPC_C]  (value not drawn)
C77  CL03A104KP3NNNC  [FP-CL03-IPC_C]  (value not drawn)
C78  CL03A104KP3NNNC  [FP-CL03-IPC_C]  (value not drawn)
C79  CL03A104KP3NNNC  [FP-CL03-IPC_C]  (value not drawn)
C80  CL03A104KP3NNNC  [FP-CL03-IPC_C]  (value not drawn)
C81  CL03A104KP3NNNC  [FP-CL03-IPC_C]  (value not drawn)
C99  CL03A104KP3NNNC  [FP-CL03-IPC_C]  (value not drawn)
M2  DCM_8520  [PCBComponent_1]  (no BOM)
M3  DCM_8520  [PCBComponent_1]  (no BOM)
M4  DCM_8520  [PCBComponent_1]  (no BOM)
M5  DCM_8520  [PCBComponent_1]  (no BOM)
M6  DCM_8520  [PCBComponent_1]  (no BOM)
M7  DCM_8520  [PCBComponent_1]  (no BOM)
M8  DCM_8520  [PCBComponent_1]  (no BOM)
Q2  DMG2305UX-7  [FP-SOT23-IPC_B]  (value not drawn)
Q3  DMG2305UX-7  [FP-SOT23-IPC_B]  (value not drawn)
Q4  DMG2305UX-7  [FP-SOT23-IPC_B]  (value not drawn)
Q5  DMG2305UX-7  [FP-SOT23-IPC_B]  (value not drawn)
R19  RC0402FR-070RL  [FP-RC0402-0_4-IPC_A]  (value not drawn)
R20  RC0402FR-070RL  [FP-RC0402-0_4-IPC_A]  (value not drawn)
R21  RC0402FR-070RL  [FP-RC0402-0_4-IPC_A]  (value not drawn)
R22  RC0402FR-070RL  [FP-RC0402-0_4-IPC_A]  (value not drawn)
R24  RMCF0603JG10K0  [FP-RMCF0603-MFG]  (value not drawn)
R28  ERJ-3RSFR10V  [FP-ERJ3R-MFG]  (value not drawn)
R29  ERJ-3RSFR10V  [FP-ERJ3R-MFG]  (value not drawn)
R30  ERJ-3EKF1653V  [RESC1608X55X30LL15T15]  (value not drawn)
R31  CRCW08055K00FKTA  [RESC2013X50X30ML20T20]  (value not drawn)
R32  ERJ-3EKF1653V  [RESC1608X55X30LL15T15]  (value not drawn)
R33  CRCW08055K00FKTA  [RESC2013X50X30ML20T20]  (value not drawn)
R34  RC0402FR-070RL  [FP-RC0402-0_4-IPC_A]  (value not drawn)
R35  RC0402FR-070RL  [FP-RC0402-0_4-IPC_A]  (value not drawn)
R36  RC0402FR-070RL  [FP-RC0402-0_4-IPC_A]  (value not drawn)
R37  RC0402FR-070RL  [FP-RC0402-0_4-IPC_A]  (value not drawn)
R38  ERJ-3RSFR10V  [FP-ERJ3R-MFG]  (value not drawn)
R39  CRCW08055K00FKTA  [RESC2013X50X30ML20T20]  (value not drawn)
R40  ERJ-3EKF1653V  [RESC1608X55X30LL15T15]  (value not drawn)
R41  ERJ-3EKF1653V  [RESC1608X55X30LL15T15]  (value not drawn)
R42  CRCW08055K00FKTA  [RESC2013X50X30ML20T20]  (value not drawn)
R43  ERJ-3RSFR10V  [FP-ERJ3R-MFG]  (value not drawn)
R47  RMCF0603JG10K0  [FP-RMCF0603-MFG]  (value not drawn)
R48  RC0402FR-070RL  [FP-RC0402-0_4-IPC_A]  (value not drawn)
R60  RMCF0603JG10K0  [FP-RMCF0603-MFG]  (value not drawn)
R64  ERJ-3RSFR10V  [FP-ERJ3R-MFG]  (value not drawn)
R65  CRCW08055K00FKTA  [RESC2013X50X30ML20T20]  (value not drawn)
R66  ERJ-3EKF1653V  [RESC1608X55X30LL15T15]  (value not drawn)
R67  ERJ-3EKF1653V  [RESC1608X55X30LL15T15]  (value not drawn)
R68  CRCW08055K00FKTA  [RESC2013X50X30ML20T20]  (value not drawn)
R69  ERJ-3RSFR10V  [FP-ERJ3R-MFG]  (value not drawn)
R71  RC0402FR-070RL  [FP-RC0402-0_4-IPC_A]  (value not drawn)
R72  RC0402FR-070RL  [FP-RC0402-0_4-IPC_A]  (value not drawn)
R73  RC0402FR-070RL  [FP-RC0402-0_4-IPC_A]  (value not drawn)
R74  RC0402FR-070RL  [FP-RC0402-0_4-IPC_A]  (value not drawn)
R78  RMCF0603JG10K0  [FP-RMCF0603-MFG]  (value not drawn)
R79  ERJ-3RSFR10V  [FP-ERJ3R-MFG]  (value not drawn)
R80  CRCW08055K00FKTA  [RESC2013X50X30ML20T20]  (value not drawn)
R81  ERJ-3EKF1653V  [RESC1608X55X30LL15T15]  (value not drawn)
R82  ERJ-3EKF1653V  [RESC1608X55X30LL15T15]  (value not drawn)
R83  CRCW08055K00FKTA  [RESC2013X50X30ML20T20]  (value not drawn)
R84  ERJ-3RSFR10V  [FP-ERJ3R-MFG]  (value not drawn)
R85  RC0402FR-070RL  [FP-RC0402-0_4-IPC_A]  (value not drawn)
R86  RC0402FR-070RL  [FP-RC0402-0_4-IPC_A]  (value not drawn)
R87  RC0402FR-070RL  [FP-RC0402-0_4-IPC_A]  (value not drawn)
R88  RC0402FR-070RL  [FP-RC0402-0_4-IPC_A]  (value not drawn)
R99  RC0402FR-070RL  [FP-RC0402-0_4-IPC_A]  (value not drawn)
U6  DRV8212DSGR  [WSON_212DSGR_TEX]
U7  TLV9152IDR  [SOIC8_D_TEX]
U8  DRV8212DSGR  [WSON_212DSGR_TEX]
U9  TLV9152IDR  [SOIC8_D_TEX]
U17  DRV8212DSGR  [WSON_212DSGR_TEX]
U18  TLV9152IDR  [SOIC8_D_TEX]
U19  DRV8212DSGR  [WSON_212DSGR_TEX]
U20  TLV9152IDR  [SOIC8_D_TEX]
U21  SN74LV4051APWR  [FP-PW0016A-MFG]

### Ports
GPIO_0 (bidir, see SingleBoardDrone_RP2350[1A], SingleBoardDrone_RP2350[2C]), I_MUX_A (bidir, see SingleBoardDrone_RP2350[1A]), I_MUX_B (bidir, see SingleBoardDrone_RP2350[3B]), I_MUX_OUT (out, see SingleBoardDrone_RP2350[3B]), M1_GPIO (bidir, see SingleBoardDrone_RP2350[1A]), M1_I (out, see SingleBoardDrone_Act[1B]), M1_I (out, see SingleBoardDrone_Act[6C]), M1_M2_VCC (bidir, see SingleBoardDrone_Act[2A]), M1_M2_VCC (bidir, see SingleBoardDrone_Act[5A]), M2_GPIO (bidir, see SingleBoardDrone_RP2350[1A]), M2_I (out, see SingleBoardDrone_Act[2B]), M2_I (out, see SingleBoardDrone_Act[6C]), M3_GPIO (bidir, see SingleBoardDrone_RP2350[1B]), M3_I (out, see SingleBoardDrone_Act[3B]), M3_I (out, see SingleBoardDrone_Act[6C]), M3_M4_VCC (bidir, see SingleBoardDrone_Act[4A]), M3_M4_VCC (bidir, see SingleBoardDrone_Act[5B]), M4_GPIO (bidir, see SingleBoardDrone_RP2350[1B]), M4_I (out, see SingleBoardDrone_Act[4B]), M4_I (out, see SingleBoardDrone_Act[6C]), M5_GPIO (bidir, see SingleBoardDrone_RP2350[1B]), M5_I (out, see SingleBoardDrone_Act[1C]), M5_I (out, see SingleBoardDrone_Act[6C]), M5_M6_VCC (bidir, see SingleBoardDrone_Act[2C]), M5_M6_VCC (bidir, see SingleBoardDrone_Act[5B]), M6_GPIO (bidir, see SingleBoardDrone_RP2350[1B]), M6_I (out, see SingleBoardDrone_Act[2C]), M6_I (out, see SingleBoardDrone_Act[6C]), M7_GPIO (bidir, see SingleBoardDrone_RP2350[1B]), M7_I (out, see SingleBoardDrone_Act[3C]), M7_I (out, see SingleBoardDrone_Act[6C]), M7_M8_VCC (bidir, see SingleBoardDrone_Act[4C]), M7_M8_VCC (bidir, see SingleBoardDrone_Act[5B]), M8_GPIO (bidir, see SingleBoardDrone_RP2350[1B]), M8_I (out, see SingleBoardDrone_Act[4C]), M8_I (out, see SingleBoardDrone_Act[6C]), MOT_EN (bidir, see SingleBoardDrone_RP2350[3B])

### Nets
+3V3: C30.1 C33.1 C76.1 C80.1 C99.2 Q2.2(SOURCE) Q3.2(SOURCE) Q4.2(SOURCE) Q5.2(SOURCE) U7.8(V+) U9.8(V+) U18.8(V+) U20.8(V+) U21.16(VCC)
GND: C28.2 C29.1 C30.2 C31.2 C32.1 C33.2 C76.2 C77.2 C78.1 C79.2 C80.2 C81.1 C99.1 R24.1 R28.2 R29.2 R31.2 R33.2 R38.2 R39.2 R42.2 R43.2 R47.1 R48.2 R60.1 R64.2 R65.2 R68.2 R69.2 R78.1 R79.2 R80.2 R83.2 R84.2 U6.4(GND) U6.9(GND) U7.4(V-) U8.4(GND) U8.9(GND) U9.4(V-) U17.4(GND) U17.9(GND) U18.4(V-) U19.4(GND) U19.9(GND) U20.4(V-) U21.7(GND) U21.8(GND)
V_Bus: C28.1 C31.1 C77.1 C79.1 U6.1(VM) U8.1(VM) U17.1(VM) U19.1(VM)
Net?_GND: ?.GND R19.1
Net?_GND_R: ?.GND_R R20.1
Net?_VM: ?.VM U6.2(OUT1)
NetC29_2: C29.2 Q2.3(DRAIN) R24.2 U6.8(VCC)
NetC32_2: C32.2 Q3.3(DRAIN) R47.2 U8.8(VCC)
NetC78_2: C78.2 Q5.3(DRAIN) R78.2 U19.8(VCC)
NetC81_2: C81.2 Q4.3(DRAIN) R60.2 U17.8(VCC)
NetM2_GND: M2.GND R22.1
NetM2_GND_R: M2.GND_R R21.1
NetM2_VM: M2.VM U6.3(OUT2)
NetM3_GND: M3.GND R35.1
NetM3_GND_R: M3.GND_R R34.1
NetM3_VM: M3.VM U8.2(OUT1)
NetM4_GND: M4.GND R37.1
NetM4_GND_R: M4.GND_R R36.1
NetM4_VM: M4.VM U8.3(OUT2)
NetM5_GND: M5.GND R73.1
NetM5_GND_R: M5.GND_R R74.1
NetM5_VM: M5.VM U17.2(OUT1)
NetM6_GND: M6.GND R71.1
NetM6_GND_R: M6.GND_R R72.1
NetM6_VM: M6.VM U17.3(OUT2)
NetM7_GND: M7.GND R87.1
NetM7_GND_R: M7.GND_R R88.1
NetM7_VM: M7.VM U19.2(OUT1)
NetM8_GND: M8.GND R85.1
NetM8_GND_R: M8.GND_R R86.1
NetM8_VM: M8.VM U19.3(OUT2)
NetQ2_1: Q2.1(GATE) Q3.1(GATE) Q4.1(GATE) Q5.1(GATE) ; port M1_M2_VCC, port M3_M4_VCC, port M5_M6_VCC, port M7_M8_VCC, port MOT_EN
NetR6_1: R99.2 ; port GPIO_0
NetR19_2: R19.2 R20.2 R29.1 U7.3(IN1+)
NetR21_2: R21.2 R22.2 R28.1 U7.5(IN2+)
NetR30_1: R30.1 R31.1 U7.7(OUT2) U21.14(Y1) ; port M2_I
NetR30_2: R30.2 U7.6(IN2-)
NetR32_1: R32.1 R33.1 U7.1(OUT1) U21.13(Y0) ; port M1_I
NetR32_2: R32.2 U7.2(IN1-)
NetR34_2: R34.2 R35.2 R38.1 U9.3(IN1+)
NetR36_2: R36.2 R37.2 R43.1 U9.5(IN2+)
NetR39_1: R39.1 R40.1 U9.1(OUT1) U21.15(Y2) ; port M3_I
NetR40_2: R40.2 U9.2(IN1-)
NetR41_1: R41.1 R42.1 U9.7(OUT2) U21.12(Y3) ; port M4_I
NetR41_2: R41.2 U9.6(IN2-)
NetR48_1: R48.1 U21.6(INH)
NetR64_1: R64.1 R71.2 R72.2 U18.5(IN2+)
NetR65_1: R65.1 R66.1 U18.7(OUT2) U21.5(Y5) ; port M6_I
NetR66_2: R66.2 U18.6(IN2-)
NetR67_1: R67.1 R68.1 U18.1(OUT1) U21.1(Y4) ; port M5_I
NetR67_2: R67.2 U18.2(IN1-)
NetR69_1: R69.1 R73.2 R74.2 U18.3(IN1+)
NetR79_1: R79.1 R85.2 R86.2 U20.5(IN2+)
NetR80_1: R80.1 R81.1 U20.7(OUT2) U21.4(Y7) ; port M8_I
NetR81_2: R81.2 U20.6(IN2-)
NetR82_1: R82.1 R83.1 U20.1(OUT1) U21.2(Y6) ; port M7_I
NetR82_2: R82.2 U20.2(IN1-)
NetR84_1: R84.1 R87.2 R88.2 U20.3(IN1+)
NetR99_1: R99.1 U21.9(C)
NetU1_4: U21.11(A) ; port I_MUX_A
NetU1_5: U6.6(IN1/PH) ; port M1_GPIO
NetU1_12: U6.5(IN2/EN) ; port M2_GPIO
NetU1_13: U8.6(IN1/PH) ; port M3_GPIO
NetU1_16: U8.5(IN2/EN) ; port M4_GPIO
NetU1_17: U17.6(IN1/PH) ; port M5_GPIO
NetU1_18: U17.5(IN2/EN) ; port M6_GPIO
NetU1_19: U19.6(IN1/PH) ; port M7_GPIO
NetU1_27: U19.5(IN2/EN) ; port M8_GPIO
NetU1_34: U21.10(B) ; port I_MUX_B
NetU1_43: U21.3(COM) ; port I_MUX_OUT

Not connected (* = marked no-connect by the designer): U6 7(MODE)*; U8 7(MODE)*; U17 7(MODE)*; U19 7(MODE)*

### Notes on the sheet
- Populate R25,26,27 to supply the VCC pin directly from GPIO (most of the current goes to the cap)... Populate R24 and Q2 to supply current via the 3V3 rail. Technically, if the caps from both drivers are powered at once via gpio, its out of spec for the RP2350
- Populate R44,45,46 to supply the VCC pin directly from GPIO (most of the current goes to the cap)... Populate R47 and Q3 to supply current via the 3V3 rail. Technically, if the caps from both drivers are powered at once via gpio, its out of spec for the RP2350
- Save the GPIOs by tying together... Def need to supply via the 3v3 rail
- 1A * .1O = .1V, 3.3 / .1 = 33 (Gain)
  Rf = 165kO Rg = 5kO Gain = 34
- Motor Current Mux
- (in symbol DCM_8520) Vroom

### Library data of the parts
? M2-M8 = DCM_8520: 8520 DC Motor
C28-C33 C76-C81 C99 = CMP-2010-00672-2: as C3 on sheet SingleBoardDrone_RP2350; Radiation Hardening: No; Voltage Rating: 10V; Dielectric: X5R; Length: 0.6mm; Voltage Rating (DC): 10V; Package Quantity: 1; Height: 0.3mm; Width: 0.012inch; Min Operating Temperature: -55°C; Lead Free: Lead Free; Tolerance: 10%; Contact Plating: Tin; Depth: 0.3mm; Max Operating Temperature: 85°C; Case/Package: 0201; Capacitance: 100nF; Mount: Surface Mount; Thickness: 0.013inch; Case Code (Metric): 0603; Case Code (Imperial): 0201; Packaging: Tape and Reel
Q2-Q5 = CMP-1693-00002-4: as Q1 on sheet SingleBoardDrone_Pow; Lead Free: Lead Free; Number of Pins: 3; Length: 3mm; Continuous Drain Current (ID): 4.2A; Contact Plating: Tin; Mount: Surface Mount; Weight: 0.000282oz; Min Operating Temperature: -55°C; Package Quantity: 3000; Drain to Source Voltage (Vdss): 20V; On-State Resistance: 52MR; Max Operating Temperature: 150°C; Height: 1.1mm; REACH SVHC: No SVHC; Packaging: Tape and Reel; Radiation Hardening: No; Case/Package: SOT-23; Width: 1.4mm
R19-R22 R34-R37 R48 R71-R74 R85-R88 R99 = CMP-2002-07342-2: as R76 on sheet SingleBoardDrone_Pow; Features: Moisture Resistant; Length: 1mm; Case Code (Metric): 1005; Series: RC; RoHS Compliant: Yes; Resistor Type: Thick Film; Height: 0.35mm; Min Operating Temperature: -55°C; Case Code (Imperial): 0402; Number of Terminations: 2; Contact Plating: Tin; Case/Package: 0402; Size Code: 0402; Termination: SMD/SMT; Max Operating Temperature: 155°C; Width: 0.5mm; Mount: Surface Mount; Lead Free: Lead Free; Packaging: Tape and Reel; Radiation Hardening: No
R24 R47 R60 R78 = CMP-26527-000153-1: as R90 on sheet SingleBoardDrone_Pow; Tolerance: 5%; Case Code (Imperial): 0603; Series: RMCF; Resistor Type: Thick Film; Length: 0.061inch; Features: Automotive AEC-Q200; Height: 0.022inch; Case Code (Metric): 1608; Width: 0.031inch; Number of Terminations: 2; Contact Plating: Tin; Case/Package: 0603; Package Quantity: 1; Max Operating Temperature: 155°C; Mount: Surface Mount; RoHS Compliant: Yes; Radiation Hardening: No; Min Operating Temperature: -55°C; Packaging: Tape and Reel
R28 R29 R38 R43 R64 R69 R79 R84 = CMP-2000-00862-2: RES 0.1 OHM 1% 1/10W 0603; Resistance: 100mR; Power Rating: 100mW; Temperature Coefficient: 300ppm/°C; Termination: SMD/SMT; Height: 0.45mm; Tolerance: 1%; Resistor Type: Thick Film; Package Quantity: 5000; Case/Package: 0603; Case Code (Metric): 1608; Lead Free: Lead Free; Military Standard: Not; Min Operating Temperature: -55°C; Construction: Rectangular; Resistance Tolerance: 1%; REACH SVHC: No SVHC; RoHS Compliant: Yes; Series: ERJ; Number of Terminations: 2; Number of Pins: 2; Length: 1.6mm; Mount: Surface Mount; Max Power Dissipation: 100mW; Width: 0.031inch; Case Code (Imperial): 0603; Contact Plating: Tin; Packaging: Tape and Reel; Radiation Hardening: No; Size Code: 0603; Technology: THICK FILM; Max Operating Temperature: 125°C; Depth: 0.8mm
R30 R32 R40 R41 R66 R67 R81 R82 = CMP-2000-00280-1: Manufacturer: Panasonic; Part Number: ERJ-3EKF1653V
R31 R33 R39 R42 R65 R68 R80 R83 = CMP-2001-04239-1: Manufacturer: Vishay Dale; Part Number: CRCW08055K00FKTA
U6 U8 U17 U19 = DRV8212DSGR: 12-V, 4-A H-bridge motor driver with auto sleep mode 8-WSON -40 to 125; Manufacturer_Name: Texas Instruments; Copyright: Copyright (C) 2025 Ultra Librarian. All rights reserved.; Manufacturer_Part_Number: DRV8212DSGR; Datasheet: https://www.ti.com/lit/gpn/drv8212; RefDes: RefDes; Type: Type
U7 U9 U18 U20 = TLV9152IDR: Dual, 16-V, 4.5-MHz, low-power operational amplifier 8-SOIC -40 to 125; Manufacturer_Name: Texas Instruments; Copyright: Copyright (C) 2025 Ultra Librarian. All rights reserved.; Manufacturer_Part_Number: TLV9152IDR; Datasheet: https://www.ti.com/lit/gpn/tlv9152; RefDes: RefDes; Type: Type
U21 = CMP-0802-00044-5: IC MUX/DEMUX 8X1 16TSSOP; Manufacturer: Texas Instruments; Max Junction Temp: +150°C; Max Supply Voltage: 5.5V; Min Supply Voltage: 2V; Mux Demux Ratio: 8:1; Standoff Height: 0.05mm; On State Resistance: 22Ω; Nominal Supply Current: 20uA; -3Db Bandwith: 35MHz; Number Of Circuits: 1; Ambient Temperature Range Low: -40°C; Ambient Temperature Range High: +85°C; Device Class L3: Multiplexers; ComponentLink2URL: http://www.ti.com/lit/ds/symlink/sn74lv4051a.pdf; Lead Free: Yes; Category: IC; Octopart: https://octopart.com/sn74lv4051apwr-texas+instruments-472550; Temperature Range High: +85°C; Temperature: -40°C to +85°C; Ipc Land Pattern Name: SOP65P640X120-16; Device Class L1: Integrated Circuits (ICs); Height: 1.2mm; Mouser Description: Multiplexer Switch ICs 8-Channel Analog; Digikey Description: IC MUX/DEMUX 8X1 16TSSOP; Device Class L2: Interface ICs; Automotive: No; Package: PW0016A; ComponentLink2Description: Datasheet; RoHS: TRUE; Temperature Range Low: -40°C; Manufacturer Part Number: SN74LV4051APWR